# EAGLE design rgb-matrix-backpack-4 (EAGLE 6.2)
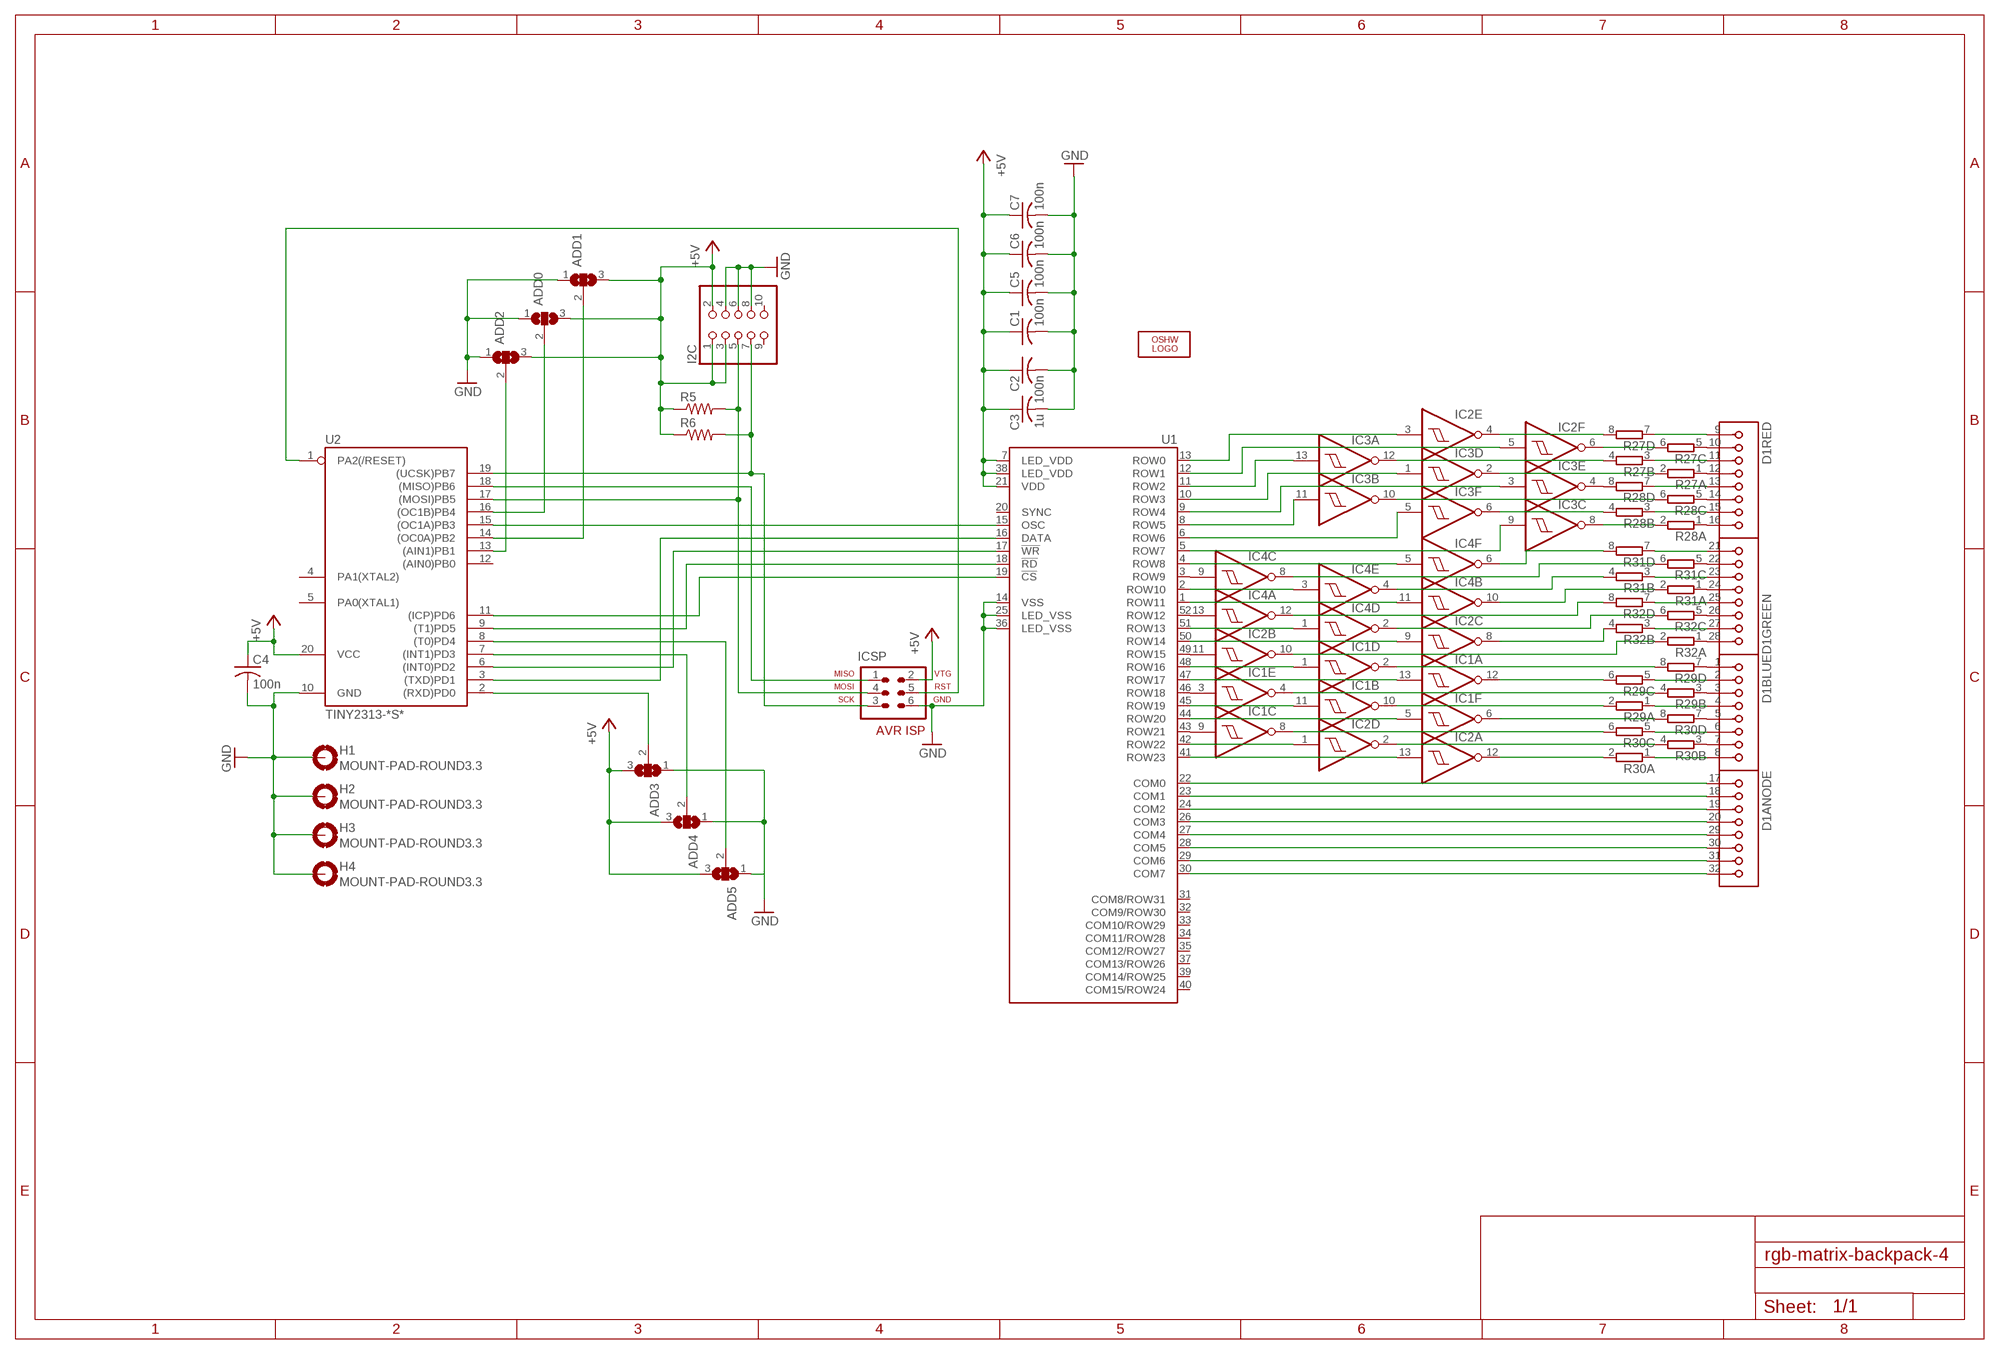
[diagram p0: schematic, sheet 1]

## Parts
ADD0  SJ2W  [SJ_2]
ADD1  SJ2W  [SJ_2]
ADD2  SJ2W  [SJ_2]
ADD3  SJ2W  [SJ_2]
ADD4  SJ2W  [SJ_2]
ADD5  SJ2W  [SJ_2]
C1  100n  C-USC0603  [C0603]
C2  100n  C-USC0603  [C0603]
C3  1u  C-USC0603  [C0603]
C4  100n  C-USC0603  [C0603]
C5  100n  C-USC0603  [C0603]
C6  100n  C-USC0603  [C0603]
C7  100n  C-USC0603  [C0603]
D1  60MM-8X8-RGB-LED-ARRAY  [60MM-8X8-RGB-MATRIX]
H1  MOUNT-PAD-ROUND3.3  [3,3-PAD]
H2  MOUNT-PAD-ROUND3.3  [3,3-PAD]
H3  MOUNT-PAD-ROUND3.3  [3,3-PAD]
H4  MOUNT-PAD-ROUND3.3  [3,3-PAD]
I2C  PINHD-2X5_2.54-90°  [2X05/90]
IC1  74AC14D  [SO14]
IC2  74AC14D  [SO14]
IC3  74AC14D  [SO14]
IC4  74AC14D  [SO14]
ICSP  AVR-ISP-6  [AVR-ISP-6]
LOGO1  OSHW_LOGO_FILLX0350-NT  [OSHW_FILLX350_NOTEXT]
R5  R-US_0207/2V  [0207/2V]
R6  R-US_0207/2V  [0207/2V]
R27  4R-NCTS742C083  [CTS742C083-RES]
R28  4R-NCTS742C083  [CTS742C083-RES]
R29  4R-NCTS742C083  [CTS742C083-RES]
R30  4R-NCTS742C083  [CTS742C083-RES]
R31  4R-NCTS742C083  [CTS742C083-RES]
R32  4R-NCTS742C083  [CTS742C083-RES]
U1  HT1632C  [QFP52_SOT379-1]
U2  TINY2313-*S*  [SO20L$]

## Nets
GND [power]: ADD0.1 ADD1.1 ADD2.1 ADD3.1 ADD4.1 ADD5.1 C1.2 C2.2 C3.2 C4.2 C5.2 C6.2 C7.2 H1.B3,3(MOUNT) H2.B3,3(MOUNT) H3.B3,3(MOUNT) H4.B3,3(MOUNT) I2C.4 I2C.6 I2C.8 ICSP.6 U1.14(VSS) U1.25(LED_VSS) U1.36(LED_VSS) U2.10(GND)
N$1: D1.9 R27.7
N$2: D1.10 R27.5
N$3: D1.11 R27.3
N$4: D1.12 R27.1
N$5: D1.13 R28.7
N$6: D1.14 R28.5
N$7: D1.15 R28.3
N$8: D1.16 R28.1
N$9: D1.1 R29.7
N$10: D1.2 R29.5
N$11: D1.3 R29.3
N$12: D1.4 R29.1
N$13: D1.5 R30.7
N$14: D1.6 R30.5
N$15: D1.7 R30.3
N$16: D1.8 R30.1
N$17: D1.21 R31.7
N$18: D1.22 R31.5
N$19: D1.23 R31.3
N$20: D1.24 R31.1
N$21: D1.25 R32.7
N$22: D1.26 R32.5
N$23: D1.27 R32.3
N$24: D1.28 R32.1
N$25 [led]: D1.17 U1.22(COM0)
N$26 [led]: D1.18 U1.23(COM1)
N$27 [led]: D1.19 U1.24(COM2)
N$28: ICSP.1 U2.18((MISO)PB6)
N$29: U1.15(OSC) U2.15((OC1A)PB3)
N$30 [led]: D1.20 U1.26(COM3)
N$31: ICSP.5 U2.1(PA2(/RESET))
N$32: IC2.12(A:O) R30.2
N$33 [led]: D1.29 U1.27(COM4)
N$34: ADD3.2 U2.2((RXD)PD0)
N$35: ADD4.2 U2.7((INT1)PD3)
N$36: I2C.5 ICSP.4 R5.2 U2.17((MOSI)PB5)
N$37: I2C.7 ICSP.3 R6.2 U2.19((UCSK)PB7)
N$38 [led]: D1.30 U1.28(COM5)
N$39: ADD5.2 U2.8((T0)PD4)
N$40 [led]: D1.31 U1.29(COM6)
N$41 [led]: D1.32 U1.30(COM7)
N$42: IC2.2(D:O) R30.4
N$43: IC1.8(C:O) R30.6
N$44: IC1.6(F:O) R30.8
N$45: IC1.10(B:O) R29.2
N$46: IC1.4(E:O) R29.4
N$47: IC1.12(A:O) R29.6
N$48: U1.16(DATA) U2.3((TXD)PD1)
N$49: U1.17(!WR!) U2.6((INT0)PD2)
N$50: U1.18(!RD!) U2.9((T1)PD5)
N$51: U1.19(!CS!) U2.11((ICP)PD6)
N$52: IC1.2(D:O) R29.8
N$53: IC3.8(C:O) R28.2
N$54: IC3.6(F:O) R28.4
N$55: IC3.10(B:O) R28.6
N$56: IC3.4(E:O) R28.8
N$57: IC3.2(D:O) R27.2
N$58: IC3.12(A:O) R27.4
N$59: IC2.6(F:O) R27.6
N$60: IC2.4(E:O) R27.8
N$61: IC4.8(C:O) R31.6
N$62: IC4.6(F:O) R31.8
N$63: IC4.4(E:O) R31.4
N$64: IC4.10(B:O) R31.2
N$65: IC4.12(A:O) R32.8
N$66: IC4.2(D:O) R32.6
N$67: IC2.8(C:O) R32.4
N$68: IC2.10(B:O) R32.2
N$69: IC3.1(D:I) U1.10(ROW3)
N$70: IC3.9(C:I) U1.5(ROW7)
N$71: IC3.5(F:I) U1.6(ROW6)
N$72: IC3.11(B:I) U1.8(ROW5)
N$73: ADD2.2 U2.13((AIN1)PB1)
N$74: IC3.3(E:I) U1.9(ROW4)
N$75: IC3.13(A:I) U1.11(ROW2)
N$76: IC2.5(F:I) U1.12(ROW1)
N$77: ADD0.2 U2.16((OC1B)PB4)
N$78: ADD1.2 U2.14((OC0A)PB2)
N$79: IC2.3(E:I) U1.13(ROW0)
N$80: IC2.13(A:I) U1.41(ROW23)
N$81: IC2.1(D:I) U1.42(ROW22)
N$82: IC1.9(C:I) U1.43(ROW21)
N$83: IC1.3(E:I) U1.46(ROW18)
N$84: IC1.11(B:I) U1.45(ROW19)
N$85: IC1.5(F:I) U1.44(ROW20)
N$86: IC1.13(A:I) U1.47(ROW17)
N$87: IC1.1(D:I) U1.48(ROW16)
N$88: IC4.3(E:I) U1.2(ROW10)
N$89: IC4.5(F:I) U1.4(ROW8)
N$90: IC4.9(C:I) U1.3(ROW9)
N$91: IC4.11(B:I) U1.1(ROW11)
N$92: IC4.13(A:I) U1.52(ROW12)
N$93: IC4.1(D:I) U1.51(ROW13)
N$94: IC2.9(C:I) U1.50(ROW14)
N$95: IC2.11(B:I) U1.49(ROW15)
VCC [power]: ADD0.3 ADD1.3 ADD2.3 ADD3.3 ADD4.3 ADD5.3 C1.1 C2.1 C3.1 C4.1 C5.1 C6.1 C7.1 I2C.1 I2C.2 I2C.3 ICSP.2 R5.1 R6.1 U1.7(LED_VDD) U1.21(VDD) U1.38(LED_VDD) U2.20(VCC) ; supply symbol labelled +5V
Unconnected: I2C.9 I2C.10 U1.20(SYNC) U1.31(COM8/ROW31) U1.32(COM9/ROW30) U1.33(COM10/ROW29) U1.34(COM11/ROW28) U1.35(COM12/ROW27) U1.37(COM13/ROW26) U1.39(COM14/ROW25) U1.40(COM15/ROW24) U2.4(PA1(XTAL2)) U2.5(PA0(XTAL1)) U2.12((AIN0)PB0)

## Power pins joined to a net without a drawn wire
GND: IC1.7(P:GND) IC2.7(P:GND) IC3.7(P:GND) IC4.7(P:GND)
VCC: IC1.14(P:VCC) IC2.14(P:VCC) IC3.14(P:VCC) IC4.14(P:VCC)

## Library data of the parts
ADD0 ADD1-ADD5 = jumper:SJ2W: SMD solder JUMPER; BOM: EXCLUDE
C1 C2 C4-C7 = resistor:C-US: CAPACITOR, American symbol; PARTNO: CC0603MRY5V9BB104
C3 = resistor:C-US: CAPACITOR, American symbol; PARTNO: CC0603ZRY5V7BB105
D1 = logos-diodes:60MM-8X8-RGB-LED-ARRAY; BOM: EXCLUDE; DNP: T
H1-H4 = holes:MOUNT-PAD-ROUND: MOUNTING PAD, round; BOM: EXCLUDE
I2C = pinhead-1:PINHD-2X5: PIN HEADER; BOM: EXCLUDE; DNP: T
IC1-IC4 = 74xx-eu:74*14: Hex schmitt trigger INVERTER; PARTNO: SN74AC14D
ICSP = avr-4:AVR-ISP-6: AVR ISP-6 Serial Programming Header; BOM: EXCLUDE
LOGO1 = OSHW:OSHW_LOGO_FILL; BOM: EXCLUDE
R5 R6 = resistor:R-US_: RESISTOR, American symbol; DNP: T; PARTNO: CF14JT4K70
R27-R32 = res-cap-arrays:4R-N: Array Chip Resistor Source: RS Component / Phycomp; PARTNO: 742C083102JPTR
U1 = logos-led-drivers:HT1632; PARTNO: HT1632C
U2 = avr-6:TINY2313*: Atmel Tiny2313 2K Flash, 128 bytes EEPROM, 128 bytes RAM; PARTNO: ATTINY2313V-10SU

## Net classes
1 power: width 0.406 mm, drill 0.381 mm
2 led: width 0.305 mm

## Board
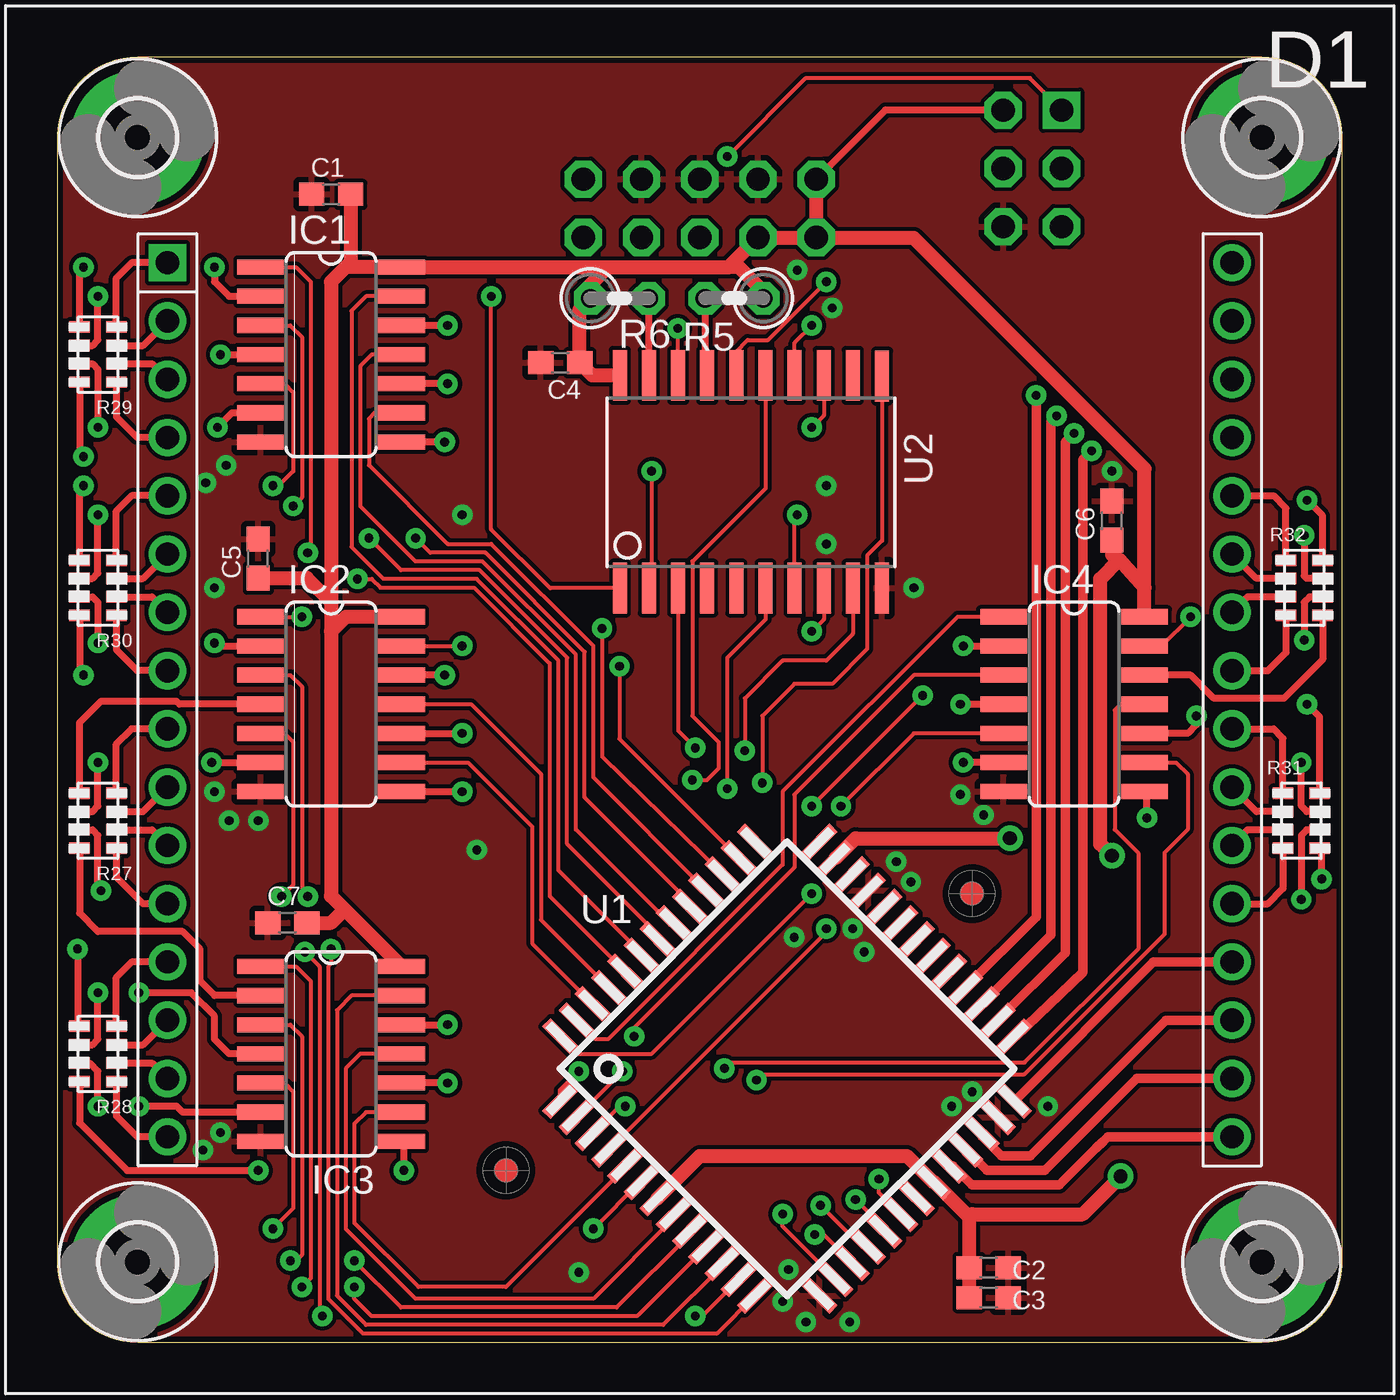
[diagram p1: board, top side]
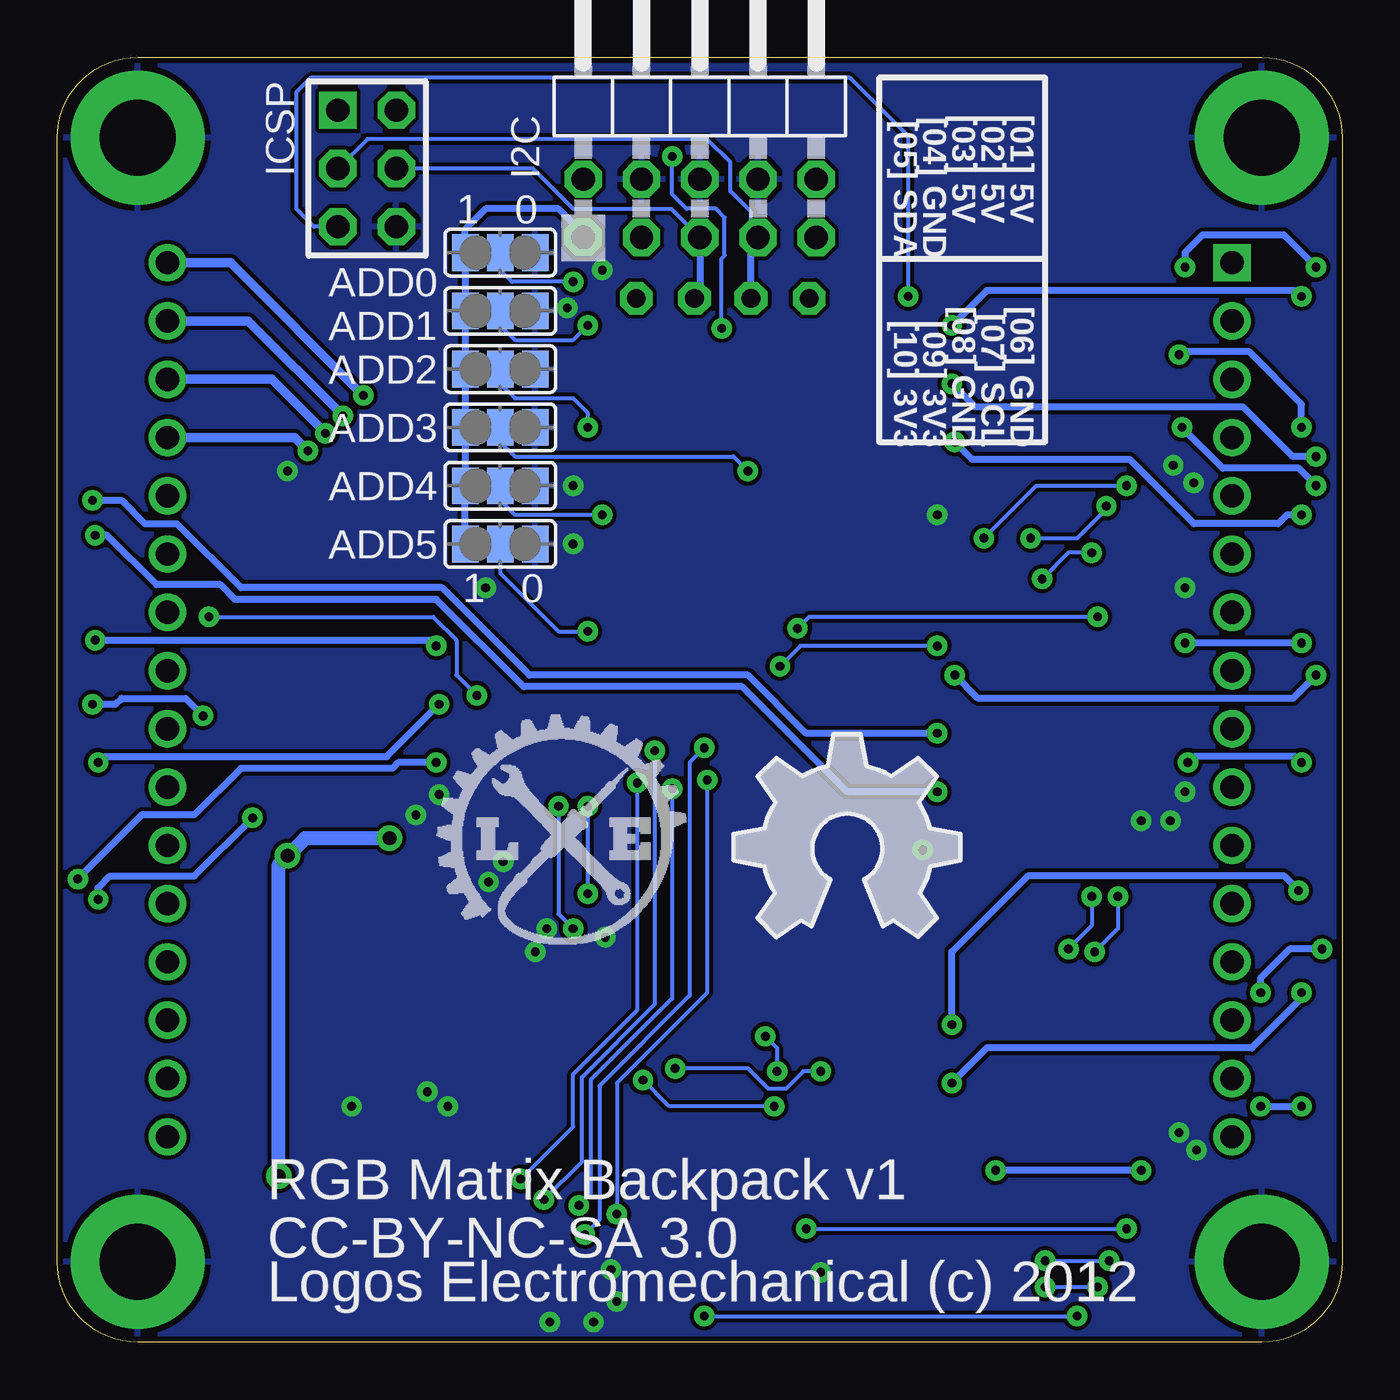
[diagram p2: board, bottom side, seen from below]

Size 56 x 56 mm. Coordinates in mm from the lower left corner, seen from the top.
Outline: 0,52.51 0,3.49 arc90 3.49,0 52.51,0 arc90 56,3.49 56,52.51 arc90 52.51,56 3.49,56 arc90 0,52.51
Copper layers (1*16): Top 0.035559375mm / dielectric 1.501140625mm / Bottom 0.035559375mm
Design rules: minimum track width 7mil, minimum drill 15mil, track to track 7mil, track to pad 7mil, pad to pad 7mil, via to via 7mil, smd to smd 0mil, copper to edge 10mil, drill to drill 8mil, minimum pad ring 12mil, minimum via ring 10mil, stop-mask expansion 0mil, vias tented up to drill 50mil, thermal gap 10mil
tRestrict: area 38.6,18.3 to 41.1,20.8; area 18.3,6.2 to 20.8,8.8
Milling: 4 lines

### Footprints (pad centres in the part's own frame; a part is rotated, then mirrored left to right if it is on the bottom)
SJ_2 = smd 1.168 x 1.6: 1 -1.524,0; 2 0,0; 3 1.524,0
C0603 = smd 1.1 x 1: 1 -0.85,0; 2 0.85,0
60MM-8X8-RGB-MATRIX = drill 1.016 square: 1 -23.2,19.05 | drill 1.016: 2 -23.2,16.51; 3 -23.2,13.97; 4 -23.2,11.43; 5 -23.2,8.89; 6 -23.2,6.35; 7 -23.2,3.81; 8 -23.2,1.27; 9 -23.2,-1.27; 10 -23.2,-3.81; 11 -23.2,-6.35; 12 -23.2,-8.89; 13 -23.2,-11.43; 14 -23.2,-13.97; 15 -23.2,-16.51; 16 -23.2,-19.05; 17 23.2,-19.05; 18 23.2,-16.51; 19 23.2,-13.97; 20 23.2,-11.43; 21 23.2,-8.89; 22 23.2,-6.35; 23 23.2,-3.81; 24 23.2,-1.27; 25 23.2,1.27; 26 23.2,3.81; 27 23.2,6.35; 28 23.2,8.89; 29 23.2,11.43; 30 23.2,13.97; 31 23.2,16.51; 32 23.2,19.05
3,3-PAD = drill 3.3 pad 5.842: B3,3 0,0
2X05/90 = drill 1.016 octagon: 1 -5.08,-6.35; 2 -5.08,-3.81; 3 -2.54,-6.35; 4 -2.54,-3.81; 5 0,-6.35; 6 0,-3.81; 7 2.54,-6.35; 8 2.54,-3.81; 9 5.08,-6.35; 10 5.08,-3.81
SO14 = smd 0.66 x 2.032: 1 -3.81,-3.073; 2 -2.54,-3.073; 3 -1.27,-3.073; 4 0,-3.073; 5 1.27,-3.073; 6 2.54,-3.073; 7 3.81,-3.073; 8 3.81,3.073; 9 2.54,3.073; 10 1.27,3.073; 11 0,3.073; 12 -1.27,3.073; 13 -2.54,3.073; 14 -3.81,3.073
AVR-ISP-6 = drill 1.016 square: 1 -2.54,-1.27 | drill 1.016 octagon: 2 -2.54,1.27; 3 0,-1.27; 4 0,1.27; 5 2.54,-1.27; 6 2.54,1.27
0207/2V = drill 0.813 octagon: 1 -1.27,0; 2 1.27,0
CTS742C083-RES = smd 0.9 x 0.5: 1 -0.8,1.2; 2 0.8,1.2; 3 -0.8,0.4; 4 0.8,0.4; 5 -0.8,-0.4; 6 0.8,-0.4; 7 -0.8,-1.2; 8 0.8,-1.2
QFP52_SOT379-1 = smd 0.5 x 1.7: 1 -6,-8; 2 -5,-8; 3 -4,-8; 4 -3,-8; 5 -2,-8; 6 -1,-8; 7 0,-8; 8 1,-8; 9 2,-8; 10 3,-8; 11 4,-8; 12 5,-8; 13 6,-8; 27 6,8; 28 5,8; 29 4,8; 30 3,8; 31 2,8; 32 1,8; 33 0,8; 34 -1,8; 35 -2,8; 36 -3,8; 37 -4,8; 38 -5,8; 39 -6,8 | smd 1.7 x 0.5: 14 8,-6; 15 8,-5; 16 8,-4; 17 8,-3; 18 8,-2; 19 8,-1; 20 8,0; 21 8,1; 22 8,2; 23 8,3; 24 8,4; 25 8,5; 26 8,6; 40 -8,6; 41 -8,5; 42 -8,4; 43 -8,3; 44 -8,2; 45 -8,1; 46 -8,0; 47 -8,-1; 48 -8,-2; 49 -8,-3; 50 -8,-4; 51 -8,-5; 52 -8,-6
SO20L$ = smd 0.61 x 2.21: 1 -5.715,-4.636; 2 -4.445,-4.636; 3 -3.175,-4.636; 4 -1.905,-4.636; 5 -0.635,-4.636; 6 0.635,-4.636; 7 1.905,-4.636; 8 3.175,-4.636; 9 4.445,-4.636; 10 5.715,-4.636; 11 5.715,4.61; 12 4.445,4.636; 13 3.175,4.636; 14 1.905,4.636; 15 0.635,4.636; 16 -0.635,4.636; 17 -1.905,4.636; 18 -3.175,4.636; 19 -4.445,4.636; 20 -5.715,4.636

### Placement (x,y rotation side)
ADD0  36.7,47.49 180 bottom
ADD1  36.7,44.95 180 bottom
ADD2  36.7,42.41 180 bottom
ADD3  36.7,39.87 180 bottom
ADD4  36.7,37.33 180 bottom
ADD5  36.7,34.79 180 bottom
C1  11.93,50.03 180 top
C2  40.59,3.25 0 top
C3  40.59,1.94 0 top
C4  21.92,42.69 180 top
C5  8.76,34.16 90 top
C6  45.97,35.81 90 top
C7  10.03,18.28 180 top
D1  28,28 0 top
H1  3.5,52.5 0 top
H2  3.5,3.5 0 top
H3  52.5,3.5 0 top
H4  52.5,52.5 0 top
I2C  28,54.5 0 bottom
IC1  11.93,43.05 270 top
IC2  11.93,27.8 270 top
IC3  11.93,12.56 270 top
IC4  44.31,27.8 270 top
ICSP  42.5,51.16 270 bottom
LOGO1  26.54,17.64 0 bottom
R5  29.5,45.5 180 top
R6  24.5,45.5 0 top
R27  1.77,22.73 180 top
R28  1.77,12.56 180 top
R29  1.77,43.05 180 top
R30  1.77,32.88 180 top
R31  54.22,22.73 0 top
R32  54.35,32.88 0 top
U1  31.81,11.92 315 top
U2  30.23,37.5 0 top
U$1  [LOGO-SM]  39.87,17.01 0 bottom
U$4  [FIDUCIAL_G10]  19.55,7.49 0 top
U$5  [FIDUCIAL_G10]  39.87,19.55 0 top

### Tracks (layer width: path | path; a pad name or v marks a point on that pad's centre or on a via)
GND  (via drill 0.38)
  other vias: 7.36,38.22 39.87,10.91 43.17,10.28 6.85,32.88 45.97,37.97 40.38,22.98 39.36,23.87 36.57,20.95 34.66,18.03 37.33,32.88 33.52,37.33 8.76,22.73 7.49,22.73 6.85,24 6.34,8.37 7.1,9.14 6.47,37.46 18.28,21.45 32.12,17.64 17.64,36.06 33.52,34.79 33.77,45.08 32.25,46.73 22.73,3.04 31.61,1.77 32.63,0.88 31.87,3.17 34.54,0.88 38.98,10.28 37.2,20.06 35.17,17.01
  pour Top: 0,52.51 0,3.49 arc90 3.49,0 52.51,0 arc90 56,3.49 56,52.51 arc90 52.51,56 3.49,56 arc90
  pour Bottom: 0,52.51 0,3.49 arc90 3.49,0 52.51,0 arc90 56,3.49 56,52.51 arc90 52.51,56 3.49,56 arc90
N$1
  Top 0.305: D1.9 3.23,26.73 2.57,26.07 R27.7
N$2
  Top 0.305: R27.5 3.73,23.12 D1.10
N$3
  Top 0.305: R27.3 4.12,22.32 D1.11
N$4
  Top 0.305: D1.12 3.73,19.11 2.57,20.27 R27.1
N$5
  Top 0.305: D1.13 3.23,16.57 2.57,15.9 R28.7
N$6
  Top 0.305: R28.5 3.73,12.96 D1.14
N$7
  Top 0.305: R28.3 4.12,12.16 D1.15
N$8
  Top 0.305: D1.16 3.48,8.95 2.57,9.86 R28.1
N$9
  Top 0.305: D1.1 3.23,47.05 2.57,46.38 R29.7
N$10
  Top 0.305: R29.5 3.73,43.45 D1.2
N$11
  Top 0.305: R29.3 4.12,42.65 D1.3
N$12
  Top 0.305: D1.4 3.48,39.43 2.57,40.34 R29.1
N$13
  Top 0.305: D1.5 3.23,36.89 2.57,36.23 R30.7
N$14
  Top 0.305: R30.5 3.73,33.28 D1.6
N$15
  Top 0.305: R30.3 4.12,32.48 D1.7
N$16
  Top 0.305: D1.8 3.48,29.27 2.57,30.18 R30.1
N$17
  Top 0.305: D1.21 52.77,19.11 53.42,19.77 R31.7
N$18
  Top 0.305: R31.5 51.88,22.32 D1.22
N$19
  Top 0.305: R31.3 52.27,23.12 D1.23
N$20
  Top 0.305: D1.24 53.01,26.73 53.42,26.32 R31.1
N$21
  Top 0.305: D1.25 52.77,29.27 53.55,30.05 R32.7
N$22
  Top 0.305: R32.5 51.88,32.48 D1.26
N$23
  Top 0.305: R32.3 52.27,33.28 D1.27
N$24
  Top 0.305: D1.28 53.01,36.89 53.55,36.35 R32.1
N$25
  Top 0.406: U1.22 39.04,7.68 39.87,6.85 43.68,6.85 45.27,8.44 45.59,8.76 45.78,8.95 D1.17
N$26
  Top 0.406: U1.23 39.61,8.38 40.51,7.49 43.05,7.49 47.05,11.49 D1.18
N$27
  Top 0.406: U1.24 40.3,8.96 41.14,8.12 42.41,8.12 48.32,14.03 D1.19
N$28  (via drill 0.38)
  Top 0.178: U2.18 27.05,44.2 v27.04,44.19 | v29.2,51.68 32.63,55.11 42.41,55.11 42.41,55.06 ICSP.1
  Bottom 0.178: v27.04,44.19 27.04,47.24 26.92,47.36 26.92,49.01 27.3,49.4 28.57,49.4 29.2,50.03 v29.2,51.68
N$29  (via drill 0.38)
  Top 0.178: U2.15 30.86,37.22 27.68,34.03 27.68,27.3 28.82,26.15 28.82,25.01 28.31,24.5 v27.68,24.5 | U1.15 31.61,5.04 v31.61,5.58
  Bottom 0.178: v27.68,24.5 27.68,15.23 31.61,11.29 v31.61,5.58
N$30
  Top 0.406: D1.20 47.77,16.57 U1.26
N$31  (via drill 0.38)
  Top 0.178: U2.1 21.48,32.86 18.91,35.42 v18.91,45.59
  Bottom 0.178: v18.91,45.59 18.91,52.57 21.45,55.11 44.95,55.11 45.59,54.48 45.59,49.4 44.81,48.62 ICSP.5
N$32  (via drill 0.38)
  Top 0.305: R30.2 0.97,29.24 v1.14,29.07 | v16.88,29.07 IC2.12
  Bottom 0.305: v1.14,29.07 2.15,28.06 15.87,28.06 v16.88,29.07
N$33  (via drill 0.38)
  Top 0.406: U1.27 41.78,13.33 44.7,16.12 44.7,38.47 v45.08,38.85
  Bottom 0.406: v45.08,38.85 45.65,39.43 D1.29
N$34  (via drill 0.38)
  Top 0.178: v25.9,37.97 25.9,32.98 U2.2
  Bottom 0.178: ADD3.2 36.7,39.23 36.06,38.6 26.54,38.6 v25.9,37.97
N$35  (via drill 0.38)
  Top 0.178: U2.7 32.14,35.95 v32.25,36.06
  Bottom 0.178: v32.25,36.06 36.06,36.06 36.7,36.7 ADD4.2
N$36
  Top 0.305: R5.2 28.23,42.23 U2.17
  Bottom 0.178: I2C.5 29.25,49.4 33.52,49.4 35.28,51.16 ICSP.4
  Bottom 0.305: I2C.5 28,45.73 R5.2
N$37
  Top 0.305: U2.19 25.79,45.48 R6.2
  Bottom 0.178: 25.77,47.84 25.77,49.27 26.66,50.16 26.66,51.43 27.68,52.44 42.49,52.44 ICSP.3
  Bottom 0.305: R6.2 25.77,47.84 I2C.7
N$38  (via drill 0.38)
  Top 0.406: U1.28 43.93,16.97 43.93,39.23 v44.31,39.62
  Bottom 0.406: v44.31,39.62 46.67,41.97 D1.30
N$39  (via drill 0.38)
  Top 0.178: U2.8 33.41,31.5 v32.88,30.98
  Bottom 0.178: ADD5.2 36.7,33.52 34.16,30.98 v32.88,30.98
N$40  (via drill 0.38)
  Top 0.406: U1.29 43.3,17.75 43.3,40.12 v43.55,40.38
  Bottom 0.406: v43.55,40.38 47.69,44.51 D1.31
N$41  (via drill 0.38)
  Top 0.406: U1.30 42.66,18.53 v42.66,41.27
  Bottom 0.406: v42.66,41.27 48.45,47.05 D1.32
N$42  (via drill 0.38)
  Top 0.305: R30.4 1.53,32.48 1.77,32.25 v1.77,30.47 | v6.85,30.47 6.98,30.47 7.1,30.34 IC2.2
  Bottom 0.305: v1.77,30.47 v6.85,30.47
N$43  (via drill 0.38)
  Top 0.305: R30.6 1.53,33.28 1.77,33.52 v1.77,36.06 | v16.88,39.23 IC1.8
  Bottom 0.305: v1.77,36.06 2.41,36.06 2.79,35.68 6.47,35.68 9.26,38.47 16.12,38.47 v16.88,39.23
N$44  (via drill 0.38)
  Top 0.305: R30.8 0.97,37.16 v1.14,37.33 | v6.98,39.87 7.61,40.51 IC1.6
  Bottom 0.305: v1.14,37.33 1.9,38.09 5.2,38.09 v6.98,39.87
N$45  (via drill 0.38)
  Top 0.305: R29.2 0.97,38.77 v1.14,38.6 | v17.01,41.77 IC1.10
  Bottom 0.305: v1.14,38.6 2.15,38.6 4.31,40.76 15.99,40.76 v17.01,41.77
N$46  (via drill 0.38)
  Top 0.305: R29.4 1.53,42.65 1.77,42.41 v1.77,39.87 | v7.1,43.05 IC1.4
  Bottom 0.305: v1.77,39.87 1.77,40.89 4.06,43.17 6.98,43.17 v7.1,43.05
N$47  (via drill 0.38)
  Top 0.305: R29.6 1.53,43.45 1.77,43.68 v1.77,45.59 | v17.01,44.31 IC1.12
  Bottom 0.305: v1.77,45.59 2.02,45.84 15.49,45.84 v17.01,44.31
N$48  (via drill 0.38)
  Top 0.178: U2.3 27.05,26.65 v27.8,25.9 | U1.16 33.38,4.69 v33.01,4.69
  Bottom 0.178: v27.8,25.9 28.44,25.27 28.44,15.11 32.38,11.17 32.38,5.33 v33.01,4.69
N$49  (via drill 0.38)
  Top 0.178: U2.6 30.86,31.5 29.2,29.84 v29.2,24.12 | U1.17 35.09,4.14 v33.27,5.96
  Bottom 0.178: v29.2,24.12 29.2,14.98 32.76,11.42 32.76,6.47 v33.27,5.96
N$50  (via drill 0.38)
  Top 0.178: U2.9 34.67,30.86 33.52,29.71 31.61,29.71 29.96,28.06 v29.96,25.77 | U1.18 36.05,4.95 v34.79,6.21
  Bottom 0.178: v29.96,25.77 29.96,14.72 33.14,11.55 33.14,7.87 v34.79,6.21
N$51  (via drill 0.38)
  Top 0.178: U2.11 35.95,34.93 35.3,34.28 35.3,30.22 33.77,28.69 32.12,28.69 30.73,27.3 v30.73,24.38 | U1.19 35.81,6.51 v35.81,7.1
  Bottom 0.178: v30.73,24.38 30.73,14.47 33.52,11.68 33.52,9.39 v35.81,7.1
N$52  (via drill 0.38)
  Top 0.305: R29.8 0.97,46.69 v1.14,46.85 | v6.85,46.85 6.85,46.22 7.49,45.59 IC1.2
  Bottom 0.305: v1.14,46.85 2.53,48.25 6.09,48.25 6.85,47.49 v6.85,46.85
N$53  (via drill 0.38)
  Top 0.305: R28.2 0.97,9.55 3.04,7.49 v8.76,7.49 | v15.11,7.49 15.11,8.65 IC3.8
  Bottom 0.305: v8.76,7.49 v15.11,7.49
N$54  (via drill 0.38)
  Top 0.305: IC3.6 5.45,10.03 5.2,10.28 v3.55,10.28 | v1.77,10.28 1.77,11.8 1.41,12.16 R28.4
  Bottom 0.305: v3.55,10.28 v1.77,10.28
N$55  (via drill 0.38)
  Top 0.305: R28.6 1.53,12.96 1.77,13.2 v1.77,15.23 | v17.01,11.29 IC3.10
  Bottom 0.305: v1.77,15.23 1.77,14.98 3.93,12.82 15.49,12.82 v17.01,11.29
N$56  (via drill 0.38)
  Top 0.305: IC3.4 7.49,12.56 6.85,13.2 6.85,14.22 5.83,15.23 v3.55,15.23 | v0.88,17.14 0.88,13.8 R28.8
  Bottom 0.305: v0.88,17.14 2.28,17.14 3.55,15.87 v3.55,15.23
N$57
  Top 0.305: IC3.2 6.85,15.11 6.21,15.74 6.21,17.14 5.45,17.9 1.77,17.9 0.97,18.7 R27.2
N$58  (via drill 0.38)
  Top 0.305: v1.9,19.68 1.77,19.8 1.77,22.09 1.53,22.32 R27.4 | IC3.12 v17.01,13.84
  Bottom 0.305: v1.9,19.68 2.53,20.31 13.71,20.31 17.01,17.01 v17.01,13.84
N$59  (via drill 0.38)
  Top 0.305: R27.6 1.53,23.12 1.77,23.36 v1.77,25.27 | v6.72,25.27 IC2.6
  Bottom 0.305: v1.77,25.27 2.02,25.52 6.47,25.52 v6.72,25.27
N$60
  Top 0.305: IC2.4 5.33,27.8 5.2,27.93 1.9,27.93 1.45,27.49 1.14,27.17 0.97,27 R27.8
N$61  (via drill 0.38)
  Top 0.305: R31.6 54.46,22.32 54.22,22.09 v54.22,19.3 | v47.49,22.85 47.49,23.89 IC4.8
  Bottom 0.305: v54.22,19.3 54.22,19.8 53.71,20.31 50.03,20.31 v47.49,22.85
N$62  (via drill 0.38)
  Top 0.305: IC4.6 v39.49,25.27 | v55.11,20.18 55.11,21.44 R31.8
  Bottom 0.305: v39.49,25.27 41.14,25.27 41.39,25.01 48,25.01 50.03,22.98 52.32,22.98 v55.11,20.18
N$63  (via drill 0.38)
  Top 0.305: R31.4 54.46,23.12 54.22,23.36 v54.22,25.27 | v39.36,27.8 IC4.4
  Bottom 0.305: v54.22,25.27 53.97,25.52 41.65,25.52 v39.36,27.8
N$64  (via drill 0.38)
  Top 0.305: R31.2 55.02,27.26 v54.48,27.8 | v49.65,27.3 49.65,26.92 49.27,26.54 IC4.10
  Bottom 0.305: v54.48,27.8 53.46,27.8 53.2,28.06 50.41,28.06 v49.65,27.3
N$65
  Top 0.305: R32.8 55.15,29.75 53.46,28.06 50.41,28.06 49.4,29.07 IC4.12
N$66  (via drill 0.38)
  Top 0.305: R32.6 54.58,32.48 54.35,32.25 v54.35,30.6 | v39.49,30.34 IC4.2
  Bottom 0.305: v54.35,30.6 39.74,30.6 v39.49,30.34
N$67  (via drill 0.38)
  Top 0.305: IC2.8 v17.64,24 | v54.35,35.17 54.35,33.39 54.46,33.28 R32.4
  Bottom 0.305: v17.64,24 21.58,24 26.15,28.57 35.68,28.57 39.49,32.38 48.25,32.38 48.89,33.01 51.68,33.01 53.84,35.17 v54.35,35.17
N$68  (via drill 0.38)
  Top 0.305: R32.2 55.15,36.02 v54.48,36.7 | IC2.10 v17.64,26.54
  Bottom 0.305: v54.48,36.7 53.2,36.7 52.19,35.68 50.79,35.68 48,32.88 39.23,32.88 35.42,29.07 25.9,29.07 23.36,26.54 v17.64,26.54
N$69  (via drill 0.38)
  Top 0.178: IC3.1 10.41,16.38 11.04,15.74 11.04,2.79 v10.66,2.41 | U1.10 25.27,1.14 13.71,1.14 12.95,1.9 v12.95,2.41
  Bottom 0.178: v12.95,2.41 v10.66,2.41
N$70
  Top 0.178: IC3.9 13.45,10.03 12.95,9.52 12.95,5.2 15.74,2.41 19.55,2.41 24.74,7.59 U1.5
N$71  (via drill 0.38)
  Top 0.178: IC3.5 9.9,11.29 10.28,10.91 10.28,5.83 v9.39,4.95 | U1.6 25.39,6.97 v23.36,4.95
  Bottom 0.178: v23.36,4.95 v9.39,4.95
N$72
  Top 0.178: IC3.11 13.2,12.56 12.56,11.93 12.56,4.95 15.61,1.9 23.36,1.9 26.86,5.4 U1.8
N$73  (via drill 0.38)
  Top 0.178: U2.13 33.41,40.39 v32.88,39.87
  Bottom 0.178: ADD2.2 36.7,41.77 36.06,41.14 33.52,41.14 32.88,40.51 v32.88,39.87
N$74  (via drill 0.38)
  Top 0.178: IC3.3 10.15,13.84 10.66,13.33 10.66,3.8 10.41,3.55 v10.15,3.55 | U1.9 27.57,4.71 24.38,1.52 14.98,1.52 v12.95,3.55
  Bottom 0.178: v12.95,3.55 v10.15,3.55
N$75
  Top 0.178: IC3.13 12.82,15.11 12.18,14.47 12.18,2.02 13.45,0.75 26.41,0.75 28.98,3.33 U1.11
N$76  (via drill 0.38)
  Top 0.178: IC2.5 9.9,26.54 10.28,26.15 10.28,19.93 v9.77,19.42 | v10.79,17.01 11.42,16.38 11.42,1.26 v11.55,1.14 | U1.12 28.1,1.14 v27.8,1.14
  Bottom 0.178: v9.77,19.42 9.77,18.03 v10.79,17.01 | v27.8,1.14 v11.55,1.14
N$77  (via drill 0.38)
  Top 0.178: U2.16 29.59,43.18 30.09,43.68 30.98,43.68 v33.52,46.22
  Bottom 0.178: v33.52,46.22 36.19,46.22 36.7,46.73 ADD0.2
N$78  (via drill 0.38)
  Top 0.178: v32.88,44.31 32.14,43.56 U2.14
  Bottom 0.178: ADD1.2 36.7,44.31 36.06,43.68 33.52,43.68 v32.88,44.31
N$79  (via drill 0.38)
  Top 0.178: IC2.3 10.15,29.07 10.66,28.57 10.66,19.68 v10.91,19.42 | v11.93,17.14 11.93,16.5 11.8,16.38 11.8,1.9 13.33,0.37 28.75,0.37 U1.13
  Bottom 0.178: v10.91,19.42 10.91,18.15 v11.93,17.14
N$80  (via drill 0.38)
  Top 0.178: IC2.13 v17.64,30.34 | v24.5,29.46 24.5,26.3 U1.41
  Bottom 0.178: v17.64,30.34 23.61,30.34 v24.5,29.46
N$81  (via drill 0.38)
  Top 0.178: IC2.1 v10.66,31.61 | v23.74,31.11 23.74,25.52 U1.42
  Bottom 0.178: v10.66,31.61 23.23,31.61 v23.74,31.11
N$82
  Top 0.178: IC1.9 13.84,40.51 13.58,40.25 13.58,38.22 17.01,34.79 18.91,34.79 23.36,30.34 23.36,24.61 U1.43
N$83  (via drill 0.38)
  Top 0.178: IC1.3 10.15,44.31 10.66,43.81 10.66,36.82 v10.28,36.44 | U1.46 26.15,17.77 22.22,21.71 22.22,29.84 18.41,33.65 14.98,33.65 v13.58,35.04
  Bottom 0.178: v13.58,35.04 11.55,35.04 10.28,36.31 v10.28,36.44
N$84
  Top 0.178: IC1.11 13.71,43.05 13.2,42.54 13.2,36.44 15.61,34.03 18.53,34.03 22.6,29.96 22.6,22.34 26.66,18.28 U1.45
N$85  (via drill 0.38)
  Top 0.178: IC1.5 9.9,41.77 10.28,41.39 10.28,37.97 9.64,37.33 v9.39,37.33 | U1.44 27.57,19.15 22.98,23.74 22.98,30.09 18.66,34.41 16.25,34.41 v15.61,35.04
  Bottom 0.178: v15.61,35.04 13.33,37.33 v9.39,37.33
N$86
  Top 0.178: IC1.13 13.45,45.59 12.82,44.95 12.82,34.66 14.22,33.27 18.28,33.27 21.84,29.71 21.84,20.57 25.45,16.96 U1.47
N$87  (via drill 0.38)
  Top 0.178: IC1.1 10.41,46.85 11.04,46.22 11.04,34.54 v10.91,34.41 | v13.07,33.27 13.71,33.27 14.09,32.88 18.15,32.88 21.45,29.58 21.45,19.45 U1.48
  Bottom 0.178: v10.91,34.41 11.93,34.41 v13.07,33.27
N$88  (via drill 0.38)
  Top 0.178: IC4.3 37.33,29.07 32.12,23.87 32.12,20.69 25.14,13.71 v25.14,13.33 | v24.63,11.8 U1.2
  Bottom 0.178: v25.14,13.33 24.63,12.82 v24.63,11.8
N$89  (via drill 0.38)
  Top 0.178: IC4.5 37.33,26.54 v34.16,23.36 | v33.52,18.03 33.52,17.87 U1.4
  Bottom 0.178: v34.16,23.36 34.16,18.66 v33.52,18.03
N$90  (via drill 0.38)
  Top 0.178: IC4.9 48.76,25.27 49.27,24.76 49.27,22.34 48.25,21.33 48.25,17.77 42.16,11.68 30.73,11.68 v30.47,11.42 | U1.3 24.51,10.28 v24.76,10.28
  Bottom 0.178: v24.76,10.28 29.33,10.28 v30.47,11.42
N$91  (via drill 0.38)
  Top 0.178: IC4.11 46.35,27.8 46.09,27.55 46.09,22.34 47.11,21.33 47.11,17.14 42.16,12.18 29.33,12.18 v29.07,11.93 | U1.1 21.91,10.99 v22.73,11.8
  Bottom 0.178: v22.73,11.8 23.49,11.8 24.25,11.04 25.01,11.04 25.9,11.93 v29.07,11.93
N$92  (via drill 0.38)
  Top 0.178: U1.52 21.91,13.25 22.6,12.56 25.9,12.56 v32.88,19.55 | IC4.13 48.12,30.34 v49.4,31.61 | v37.71,28.19 v32.88,23.36
  Bottom 0.178: v49.4,31.61 39.62,31.61 38.6,30.6 38.6,29.07 v37.71,28.19 | v32.88,23.36 v32.88,19.55
N$93
  Top 0.178: IC4.1 39.23,31.61 31.61,24 31.61,20.82 24,13.2 23.46,13.2 U1.51
N$94
  Top 0.178: IC2.9 17.9,25.27 20.69,22.47 20.69,17.38 U1.50
N$95
  Top 0.178: IC2.11 18.03,27.8 21.07,24.76 21.07,18.41 U1.49
VCC  (via drill 0.6)
  Top 0.305: ICSP.2 36.09,53.7 I2C.2
  Top 0.406: 12.04,19.34 12.51,18.86
  Top 0.61: 12.56,46.85 IC1.14 24,46.85 | 12.56,46.85 11.93,46.22 11.93,32.25 | 11.93,32.25 11.93,30.98 | 24,46.85 29.25,46.85 | 29.25,46.85 I2C.3 I2C.1 | I2C.1 I2C.2 | IC2.14 12.56,31.61 11.93,30.98 | U2.20 23.32,42.14 C4.1 22.77,45.04 R6.1 23.23,46.09 24,46.85 | R5.1 30.77,45.8 29.71,46.85 29.25,46.85 | IC4.14 47.39,32.88 | 47.39,32.88 47.39,38.07 37.33,48.12 33.1,48.12 I2C.1 | 11.93,30.98 11.93,19.45 12.51,18.86 | 12.51,18.86 13.15,18.23 IC3.14 | C1.1 12.78,47.07 12.56,46.85 | C5.1 10.88,33.3 11.93,32.25 | C6.1 45.97,34.31 46.3,34.1 | 46.3,34.1 47.39,32.88 | 39.87,5.58 39.62,5.58 38.23,6.97 U1.21 37.02,8.12 28.01,8.12 U1.7 | 39.87,5.58 44.7,5.58 v46.35,7.23 | v45.97,21.2 45.46,21.71 45.46,33.27 46.3,34.1 | C3.1 C2.1 39.74,5.46 39.87,5.58 | U1.38 34.79,21.96 v41.52,21.96 | C7.1 11.93,18.28 12.51,18.86
  Bottom 0.305: ADD0.3 38.22,47.24 | ADD0.3 ADD1.3 ADD2.3 ADD3.3 ADD4.3 ADD5.3 | ADD0.3 38.22,48.51 37.33,49.4 34.16,49.4 33.1,48.34 33.1,48.17 I2C.1
  Bottom 0.61: v46.35,7.23 46.35,20.82 v45.97,21.2 45.2,21.96 v41.52,21.96

### Text on the board
bPlace: [01] 5V | [02] 5V | [03] 5V | [04] GND | [05] SDA | [06] GND | [07] SCL | [08] GND | [09] 3V3 | [10] 3V3 | RGB Matrix Backpack v1 | CC-BY-NC-SA 3.0 | Logos Electromechanical (c) 2012
bNames: 0 | 1 | 0 | 1